# Altium schematic sheet Fri3d_2024_Exp0-Frame_01.SchDoc: Communicator Frame
size A3; Date: 18/06/2024; DrawnBy: Wim Van Gool; DocumentNumber: 1; Revision: 00; SheetNumber: 1; SheetTotal: 1
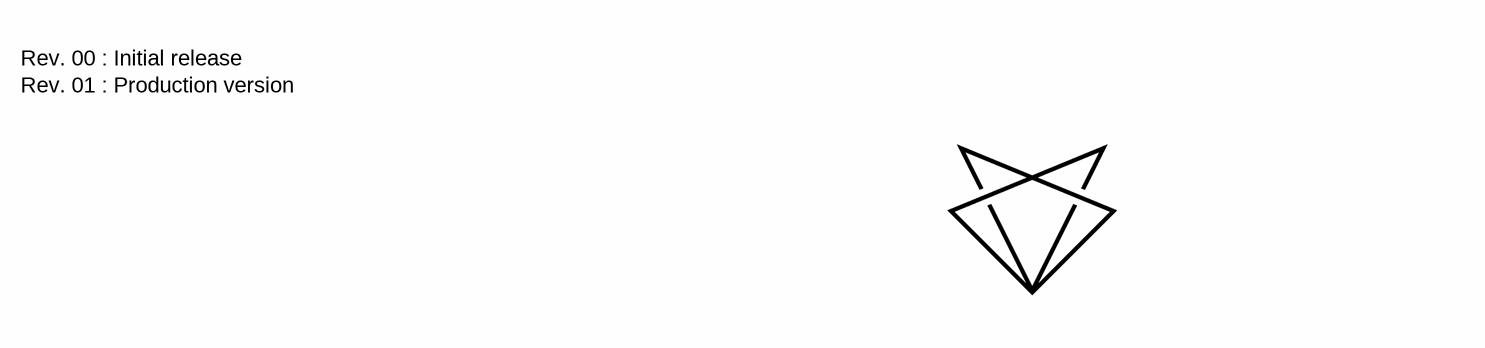
[diagram p0: Fri3d_2024_Exp0-Frame_01.SchDoc]

## Notes on the sheet
- Rev. 00 : Initial release
- Rev. 01 : Production version
- Title
- Revision
- Date
- Dranw By
- Size
- A3
- Sheet
- of